# EasyEDA Pro project ProDoc_PCB1_2026-01-17.epro

# Board PCB1
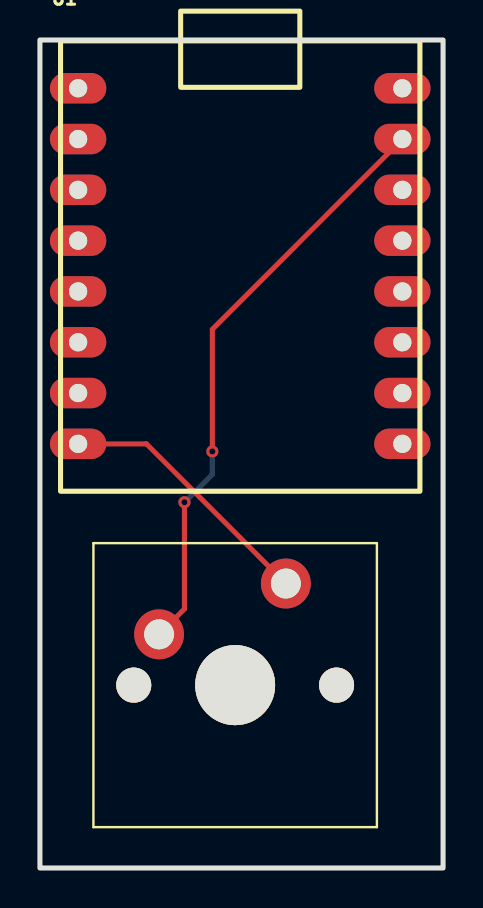
[diagram p0: board, top side]
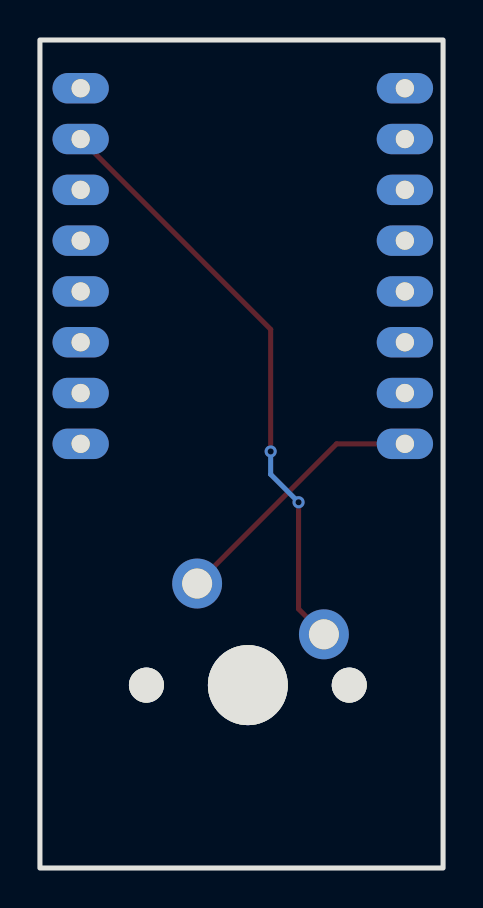
[diagram p1: board, bottom side, seen from below]

Outline 20.19 x 41.4 mm; copper layers: Top Layer, Bottom Layer. Coordinates in mm from the lower left corner of the outline.
Outline path: rectangle 0,41.4 20.19,0
Stack: Top Layer 0.035mm / Dielectric1 1.51mm FR4 er 4.5 / Bottom Layer 0.035mm

## Design rules (mm)
template: JLCPCB Capability(Two Layers Board)
spacing copperThickness1oz (default): track to track 0.102, other pairs 0.152 to 0.3
spacing copperThickness2oz: track to track 0.203, other pairs 0.152 to 0.3
track width copperThickness1oz (default): min 0.127, default 0.254, max 2.54
track width copperThickness2oz: min 0.203, default 0.254, max 2.54
differential pair differentialPair (default): width min 0.127, default 0.254, max 2.54; gap min 0.152, default 0.152
via viaSize (default): diameter min 0.5, default 0.61, max 10; hole min 0.3, default 0.305, max 6.3

## Placement (name value [footprint] x y rotation side)
SW1  SW_Push  [Switch_Keyboard_Cherry_MX:SW_Cherry_MX_PCB_1.00u]  9.78 9.14 0 top
U1  -  [ESP32 C3 SUPER MINI]  10.03 30.1 0 top

## Footprints (pads in the part's own frame, mm; a bottom-side part is the same pattern mirrored in y, then rotated)
ESP32 C3 SUPER MINI
  oval 2.824x1.524 hole 0.914: 1(-8.12,8.89) 2(-8.12,6.35) 3(-8.12,3.81) 4(-8.12,1.27) 5(-8.12,-1.27) 6(-8.12,-3.81) 7(-8.12,-6.35) 8(-8.12,-8.89) 9(8.12,-8.89) 10(8.12,-6.35) 11(8.12,-3.81) 12(8.12,-1.27) 13(8.12,1.27) 14(8.12,3.81) 15(8.12,6.35) 16(8.12,8.89)
Switch_Keyboard_Cherry_MX:SW_Cherry_MX_PCB_1.00u
  round 2.5 hole 1.5: 1(-3.81,2.54) 2(2.54,5.08)
  round 1.75 hole 1.75: 3(5.08,0) 5(-5.08,0)
  round 4 hole 4: 4(0,0)

## Nets
GND: SW1.1 U1.15
$1N305: SW1.2 U1.8

Pads without a net: SW1 3 4 5; U1 1 2 3 4 5 6 7 9 10 11 12 13 14 16

## Via types
v1: diameter 0.61, hole 0.305, Top Layer to Bottom Layer, 2 vias

## Routing (per net, layer and track width the routed paths; a pad name or vN(x,y) marks a point on that pad's centre or on a via; arc(x,y) is an arc through that point)
GND: length 29.8
  Top Layer w0.254: SW1.1 7.24,12.95 v1(7.24,18.29) ; v1(8.64,20.83) 8.64,26.93 U1.15
  Bottom Layer w0.254: v1(7.24,18.29) 8.64,19.69 v1(8.64,20.83)
$1N305: length 13.3
  Top Layer w0.254: SW1.2 5.33,21.21 U1.8
